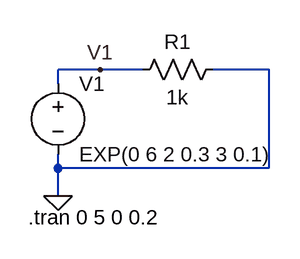
[diagram p0: schematic E2-Fuente-exponencial.asc]
E2-Fuente-exponencial.asc, the LTspice schematic file:
Version 4
SHEET 1 880 680
WIRE -1216 160 -1264 160
WIRE -1168 160 -1216 160
WIRE -1024 160 -1088 160
WIRE -1264 176 -1264 160
WIRE -1264 272 -1264 256
WIRE -1024 272 -1024 160
WIRE -1024 272 -1264 272
WIRE -1264 304 -1264 272
FLAG -1264 304 0
FLAG -1216 160 V1
SYMBOL res -1072 144 R90
WINDOW 0 0 56 VBottom 2
WINDOW 3 32 56 VTop 2
SYMATTR InstName R1
SYMATTR Value 1k
SYMATTR SpiceLine pwr=1
SYMBOL voltage -1264 160 R0
WINDOW 123 0 0 Left 0
WINDOW 39 0 0 Left 0
SYMATTR InstName V1
SYMATTR Value EXP(0 6 2 0.3 3 0.1)
TEXT -1298 328 Left 2 !.tran 0 5 0 0.2

The netlist it stands for:
* E2-Fuente-exponencial.asc
R1 0 V1 1k pwr=1
V1 V1 0 EXP(0 6 2 0.3 3 0.1)
.tran 0 5 0 0.2
.backanno
.end